# Altium schematic sheet 01.SchDoc
size 297 x 209 mm
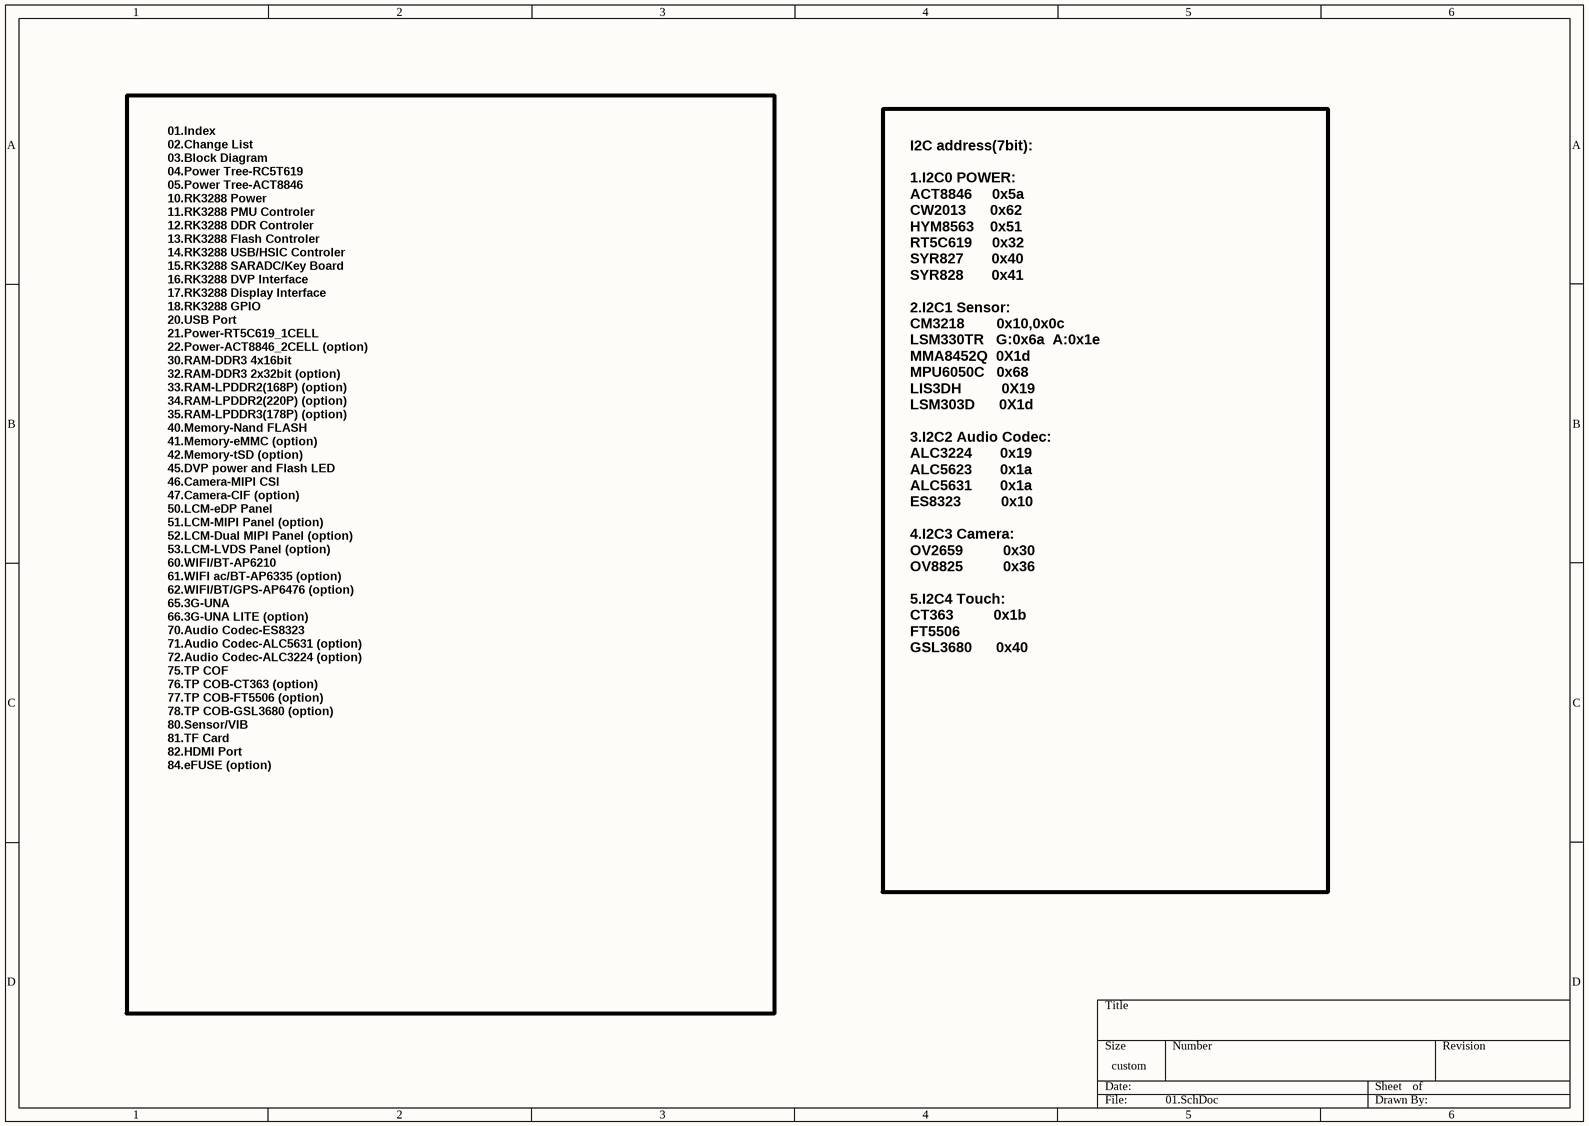
[diagram p0: 01.SchDoc]

## Notes on the sheet
- 01.Index
  02.Change List
  03.Block Diagram
  04.Power Tree-RC5T619
  05.Power Tree-ACT8846
  10.RK3288 Power
  11.RK3288 PMU Controler
  12.RK3288 DDR Controler
  13.RK3288 Flash Controler
  14.RK3288 USB/HSIC Controler
  15.RK3288 SARADC/Key Board
  16.RK3288 DVP Interface
  17.RK3288 Display Interface
  18.RK3288 GPIO
  20.USB Port
  21.Power-RT5C619_1CELL
  22.Power-ACT8846_2CELL (option)
  30.RAM-DDR3 4x16bit
  32.RAM-DDR3 2x32bit (option)
  33.RAM-LPDDR2(168P) (option)
  34.RAM-LPDDR2(220P) (option)
  35.RAM-LPDDR3(178P) (option)
  40.Memory-Nand FLASH
  41.Memory-eMMC (option)
  42.Memory-tSD (option)
  45.DVP power and Flash LED
  46.Camera-MIPI CSI
  47.Camera-CIF (option)
  50.LCM-eDP Panel
  51.LCM-MIPI Panel (option)
  52.LCM-Dual MIPI Panel (option)
  53.LCM-LVDS Panel (option)
  60.WIFI/BT-AP6210
  61.WIFI ac/BT-AP6335 (option)
  62.WIFI/BT/GPS-AP6476 (option)
  65.3G-UNA
  66.3G-UNA LITE (option)
  70.Audio Codec-ES8323
  71.Audio Codec-ALC5631 (option)
  72.Audio Codec-ALC3224 (option)
  75.TP COF
  76.TP COB-CT363 (option)
  77.TP COB-FT5506 (option)
  78.TP COB-GSL3680 (option)
  80.Sensor/VIB
  81.TF Card
  82.HDMI Port
  84.eFUSE (option)
- I2C address(7bit):
  1.I2C0 POWER:
  ACT8846     0x5a
  CW2013      0x62
  HYM8563    0x51
  RT5C619     0x32
  SYR827       0x40
  SYR828       0x41
  2.I2C1 Sensor:
  CM3218        0x10,0x0c
  LSM330TR   G:0x6a  A:0x1e
  MMA8452Q  0X1d
  MPU6050C   0x68
  LIS3DH          0X19
  LSM303D      0X1d
  3.I2C2 Audio Codec:
  ALC3224       0x19
  ALC5623       0x1a
  ALC5631       0x1a
  ES8323          0x10
  4.I2C3 Camera:
  OV2659          0x30
  OV8825          0x36
  5.I2C4 Touch:
  CT363          0x1b
  FT5506
  GSL3680      0x40